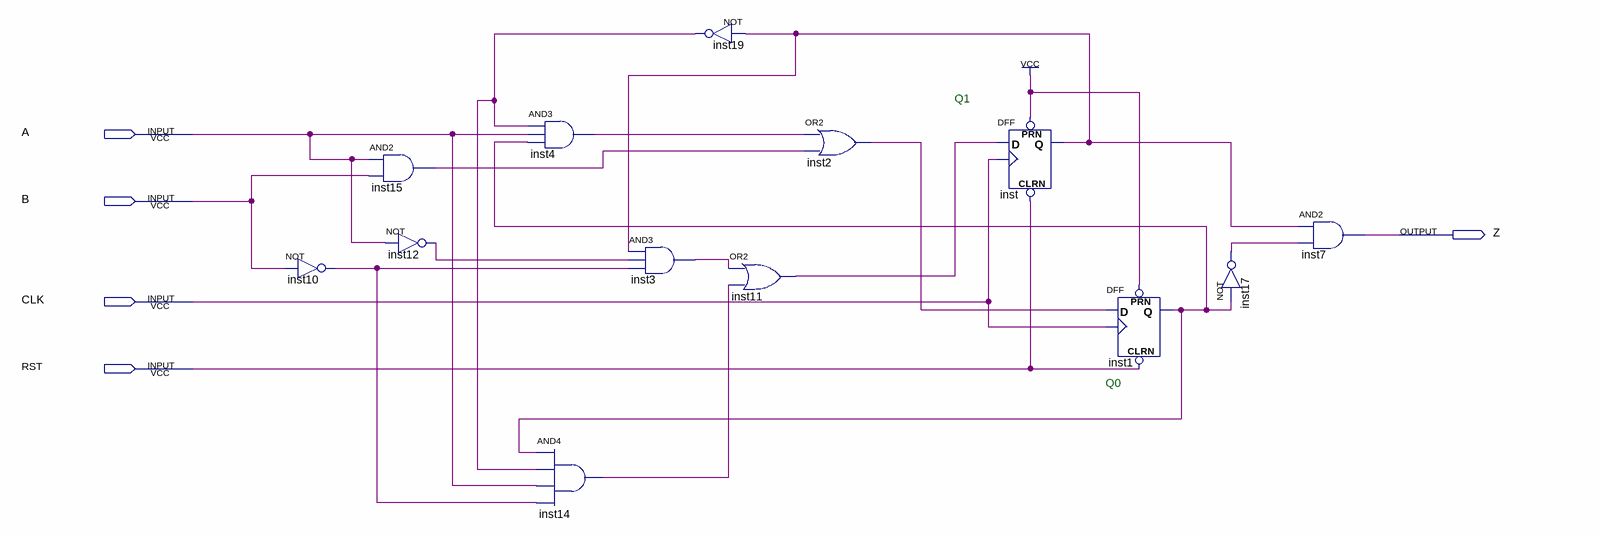
[diagram p0: schematic sheet]
// Quartus schematic Ex9.bdf as structural Verilog: 13 symbols, 5 pins
module Ex9 (
  input  A,
  input  B,
  input  CLK,
  input  RST,
  output Z
);

  wire inst1_q, inst2_out, inst3_out, inst4_out, inst10_out, inst11_out, inst12_out, inst14_out, inst15_out,
       inst17_out, inst19_out, inst_q;

  not inst10 (inst10_out, B);
  and inst15 (inst15_out, A, B);
  not inst12 (inst12_out, A);
  and inst4 (inst4_out, inst19_out, A, inst1_q);
  and inst14 (inst14_out, inst1_q, inst19_out, A, inst10_out);
  and inst3 (inst3_out, inst_q, inst12_out, inst10_out);
  not inst19 (inst19_out, inst_q);
  or inst11 (inst11_out, inst3_out, inst14_out);
  or inst2 (inst2_out, inst4_out, inst15_out);
  DFF inst (.CLRN(RST), .CLK(CLK), .D(inst11_out), .PRN(1'b1), .Q(inst_q));
  DFF inst1 (.CLRN(RST), .CLK(CLK), .D(inst2_out), .PRN(1'b1), .Q(inst1_q));
  not inst17 (inst17_out, inst1_q);
  and inst7 (Z, inst_q, inst17_out);

  // Notes on the sheet:
  //   Q1
  //   Q0
endmodule
